# EasyEDA schematic SCHSource_EasyEDA.json
TITLE: EDA-322307-02A: PMIC module; REV: A; Date: 2021-06-08; Sheet: 1/1; Drawn By: Wesley Mays; Company: Bluestone Industries
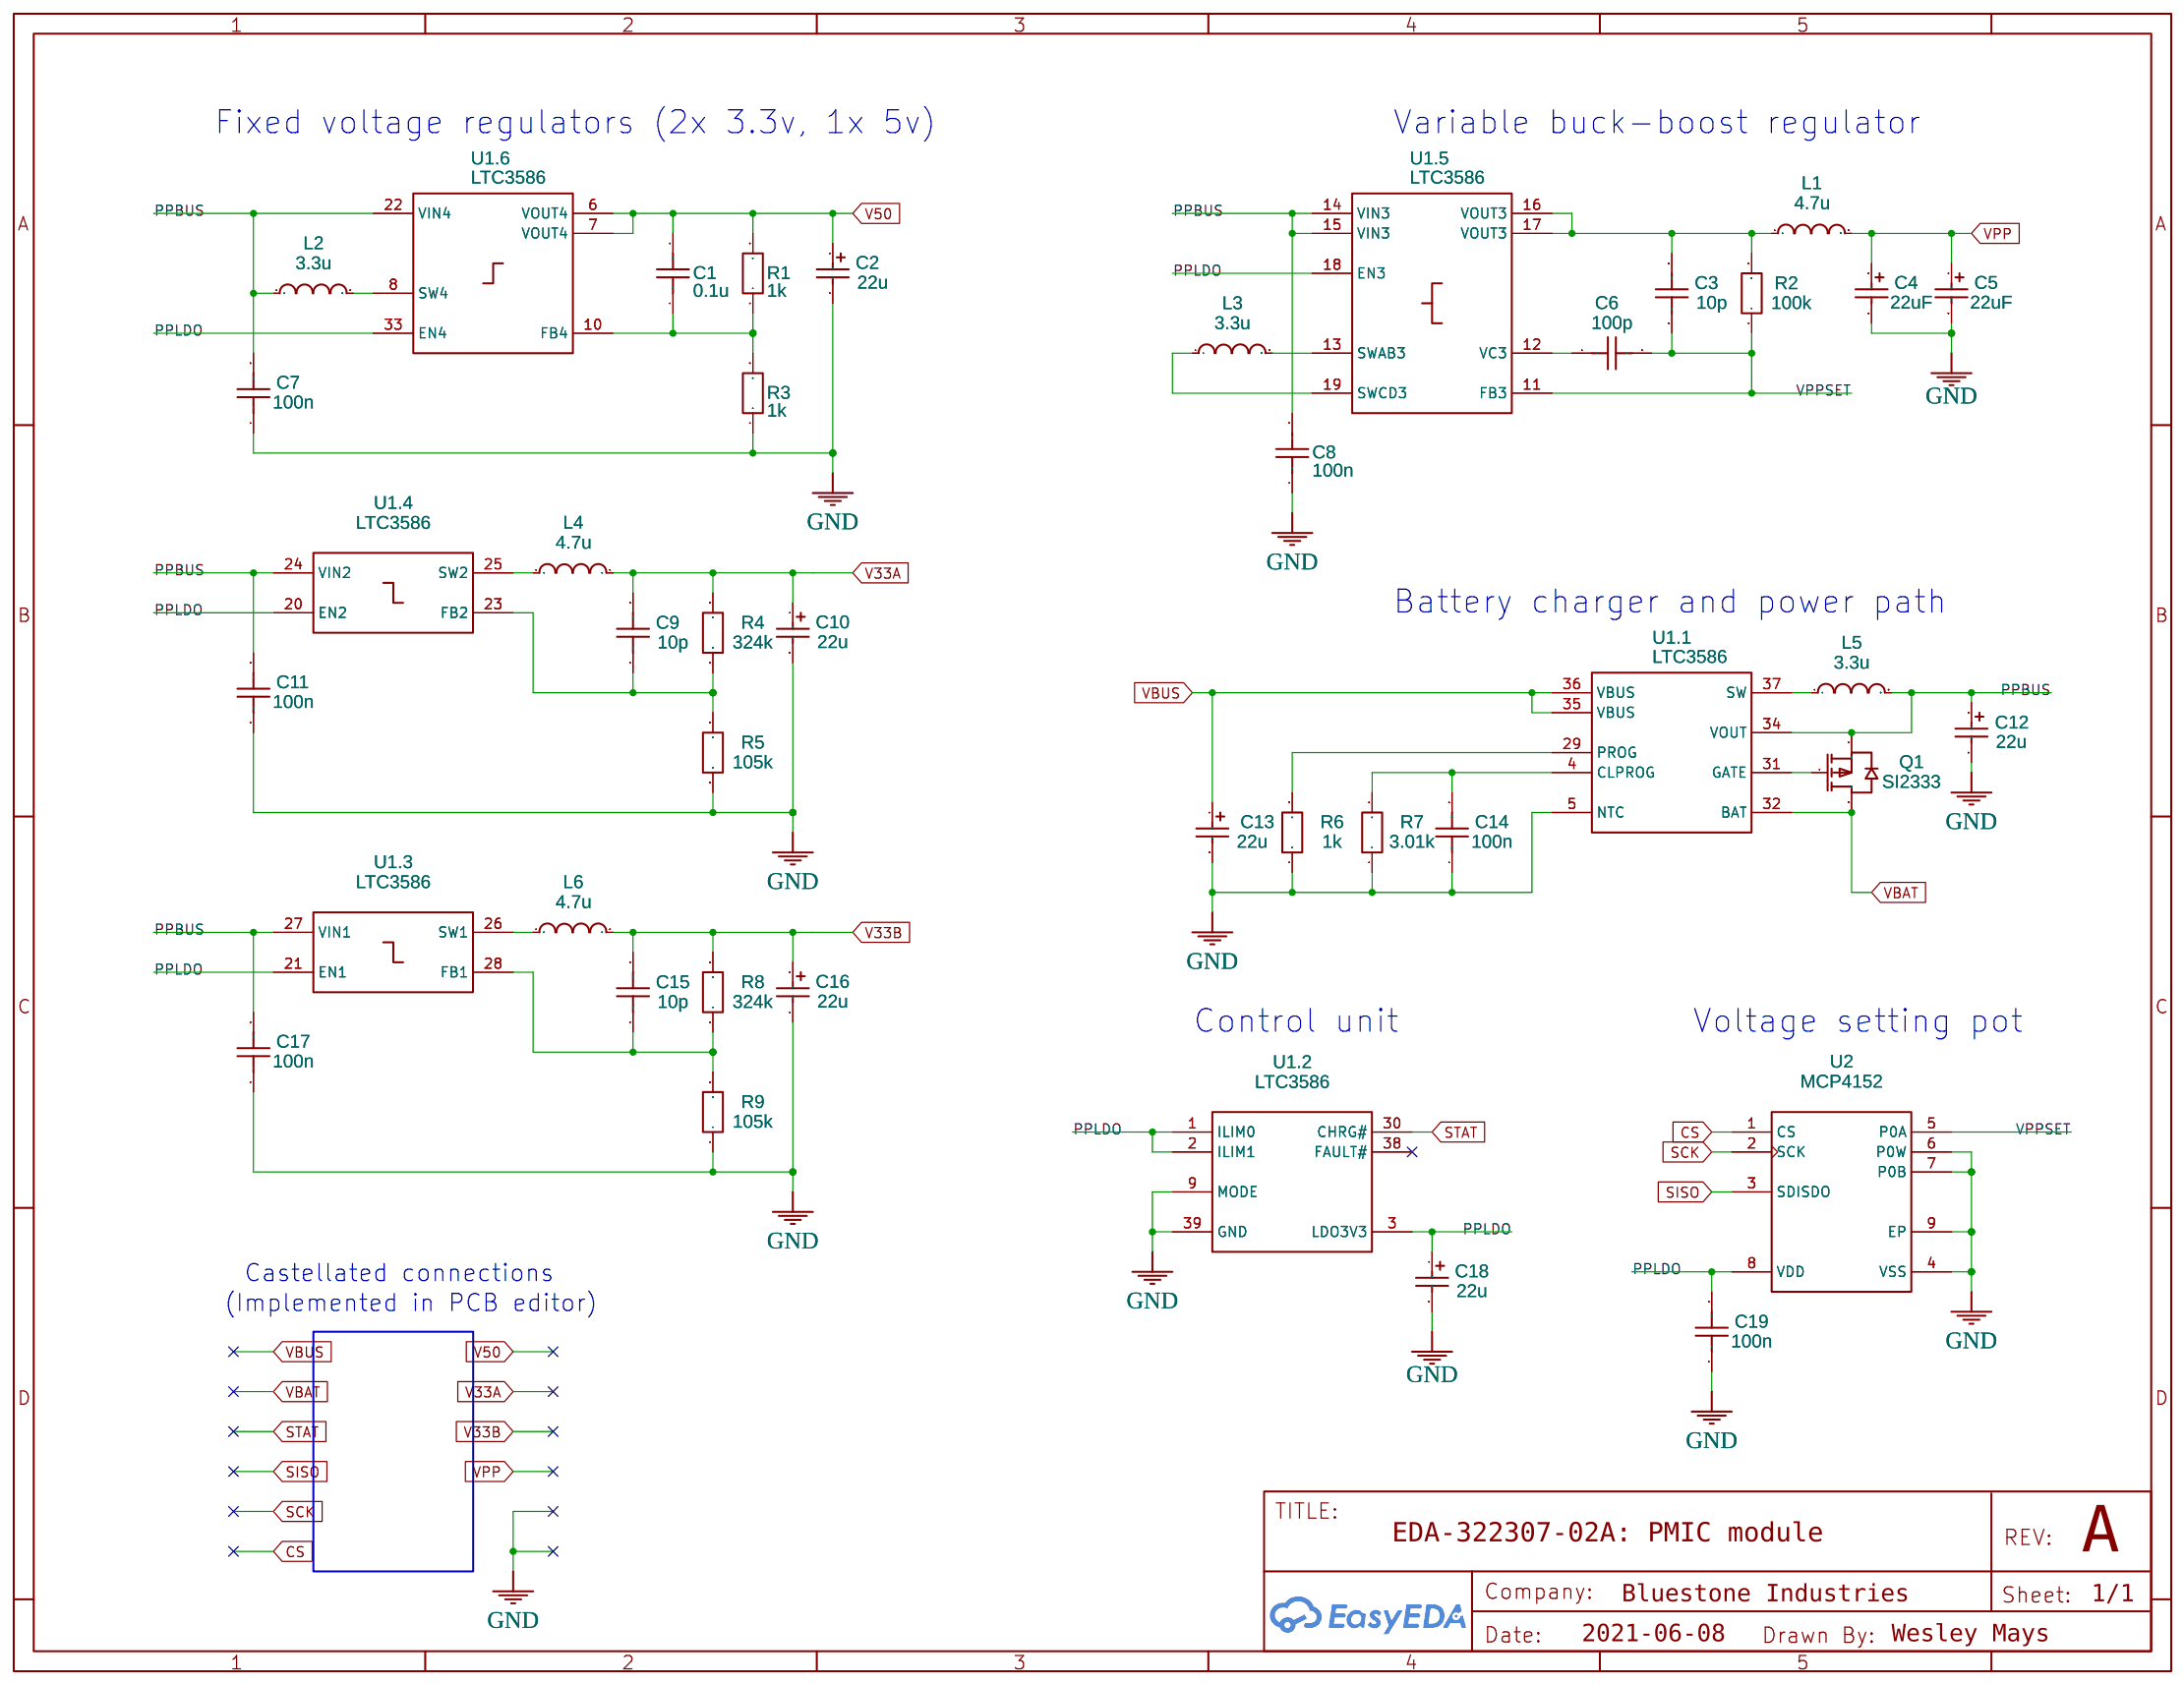
[diagram p0: schematic sheet]

## Parts
C1  0.1u  [C0805]
C2  22u  [CAP-SMD_L3.2-W1.6-R-RD]
C3  10p  [C0805]
C4  22uF  [CAP-SMD_L3.5-W2.8-R-RD]
C5  22uF  [CAP-SMD_L3.5-W2.8-R-RD]
C6  100p  [C0805]
C7  100n  [C0805]
C8  100n  [C0805]
C9  10p  [C0805]
C10  22u  [CAP-SMD_L3.2-W1.6-R-RD]
C11  100n  [C0805]
C12  22u  [CAP-SMD_L3.2-W1.6-R-RD]
C13  22u  [CAP-SMD_L3.2-W1.6-R-RD]
C14  100n  [C0805]
C15  10p  [C0805]
C16  22u  [CAP-SMD_L3.2-W1.6-R-RD]
C17  100n  [C0805]
C18  22u  [CAP-SMD_L3.2-W1.6-R-RD]
C19  100n  [C0805]
L1  4.7u  [IND-SMD_L4.0-W4.0]
L2  3.3u  [IND-SMD_L4.0-W4.0_SMNR4012]
L3  3.3u  [IND-SMD_L4.0-W4.0_SMNR4012]
L4  4.7u  [IND-SMD_L4.0-W4.0]
L5  3.3u  [IND-SMD_L4.0-W4.0_SMNR4012]
L6  4.7u  [IND-SMD_L4.0-W4.0]
Q1  SI2333  [SOT-23_L2.9-W1.3-P1.90-LS2.4-BR]
R1  1k  [R0805]
R2  100k  [R0805]
R3  1k  [R0805]
R4  324k  [R0805]
R5  105k  [R0805]
R6  1k  [R0805]
R7  3.01k  [R0805]
R8  324k  [R0805]
R9  105k  [R0805]
U1  LTC3586  [QFN-38_L4.0-W6.0-P0.40-BL-EP]  (sections 1,2,3,4,5,6)
U2  MCP4152  [DFN-MF8]

## Library data of the parts
C1 C3 C6-C9 C11 C14 C15 C17 C19 = C_0805_US: Contributor: LCEDA_Lib
C2 C10 C12 C13 C16 C18 = TAJA226K010RNJ: Supplier: LCSC; Manufacturer: AVX; Supplier Part: C11366; JLCPCB Part Class: Extended Part
C4 C5 = TAJB226K020RNJ: Supplier: LCSC; Manufacturer: AVX; Supplier Part: C7199; JLCPCB Part Class: Extended Part
L1 L4 L6 = SWPA4026S4R7MT: Supplier: LCSC; Manufacturer: Sunlord; Supplier Part: C87985
L2 L3 L5 = SWPA4030S3R3MT: Supplier: LCSC; Manufacturer: Sunlord; Supplier Part: C15269; JLCPCB Part Class: Extended Part
Q1 = SI2333: Supplier: LCSC; Supplier Part: C344008; Manufacturer: Bourne Semicon (Shenzhen); Contributor: LCSC; JLCPCB Part Class: Extended Part
R1-R9 = R_0805_EU: Contributor: LCEDA_Lib
U1 = LTC3586: Supplier: LCSC; Supplier Part: C685103; Manufacturer: Analog Devices; Manufacturer Part: LTC3586EUFE#TRPBF; Contributor: Wesley Mays; link: https://www.analog.com/media/en/technical-documentation/data-sheets/3586fb.pdf; subpart_no: 1
U2 = MCP4152T-103EMF: 78-Bit SingleDual SPI Digital POT with Volatile Memory, 8-Pin DFN, Extended Temperature, Tape and Reel

## Nets
GND: C2.2 C4.2 C5.2 C7.1 C8.1 C10.2 C11.1 C12.2 C13.2 C14.1 C16.2 C17.1 C18.2 C19.1 R3.1 R5.1 R6.1 R7.1 R9.1 U1.5(NTC) U1.9(MODE) U1.39(GND) U2.4(VSS) U2.6(P0W) U2.7(P0B) U2.9(EP)
V33A: C9.2 C10.1 L4.2 R4.2
V33B: C15.2 C16.1 L6.2 R8.2
V50: C1.2 C2.1 R1.2 U1.6(VOUT4) U1.7(VOUT4)
VBAT: Q1.3(D) U1.32(BAT)
VBUS: C13.1 U1.35(VBUS) U1.36(VBUS)
CS: U2.1(CS)
PPBUS: C7.2 C8.2 C11.2 C12.1 C17.2 L2.1 L5.2 Q1.2(S) U1.14(VIN3) U1.15(VIN3) U1.22(VIN4) U1.24(VIN2) U1.27(VIN1) U1.34(VOUT)
PPLDO: C18.1 C19.2 U1.1(ILIM0) U1.2(ILIM1) U1.3(LDO3V3) U1.18(EN3) U1.20(EN2) U1.21(EN1) U1.33(EN4) U2.8(VDD)
SCK: U2.2(SCK)
SISO: U2.3(SDISDO)
STAT: U1.30(CHRG#)
VPP: C4.1 C5.1 L1.2
VPPSET: C3.1 C6.2 R2.1 U1.11(FB3) U2.5(P0A)
Net-(C1-1): C1.1 R1.1 R3.2 U1.10(FB4)
Net-(C3-2): C3.2 L1.1 R2.2 U1.16(VOUT3) U1.17(VOUT3)
Net-(C6-1): C6.1 U1.12(VC3)
Net-(C9-1): C9.1 R4.1 R5.2 U1.23(FB2)
Net-(C14-2): C14.2 R7.2 U1.4(CLPROG)
Net-(C15-1): C15.1 R8.1 R9.2 U1.28(FB1)
Net-(L2-2): L2.2 U1.8(SW4)
Net-(L3-1): L3.1 U1.19(SWCD3)
Net-(L3-2): L3.2 U1.13(SWAB3)
Net-(L4-1): L4.1 U1.25(SW2)
Net-(L5-1): L5.1 U1.37(SW)
Net-(L6-1): L6.1 U1.26(SW1)
Net-(Q1-1): Q1.1(G) U1.31(GATE)
Net-(R6-2): R6.2 U1.29(PROG)

Not connected (* = marked no-connect by the designer): U1 38(FAULT#)*

## Notes on the sheet
- Fixed voltage regulators (2x 3.3v, 1x 5v)
- Variable buck-boost regulator
- Battery charger and power path
- Control unit
- Voltage setting pot
- Castellated connections
- (Implemented in PCB editor)
